# EAGLE design Sensor_Sound (EAGLE 9.6.2)
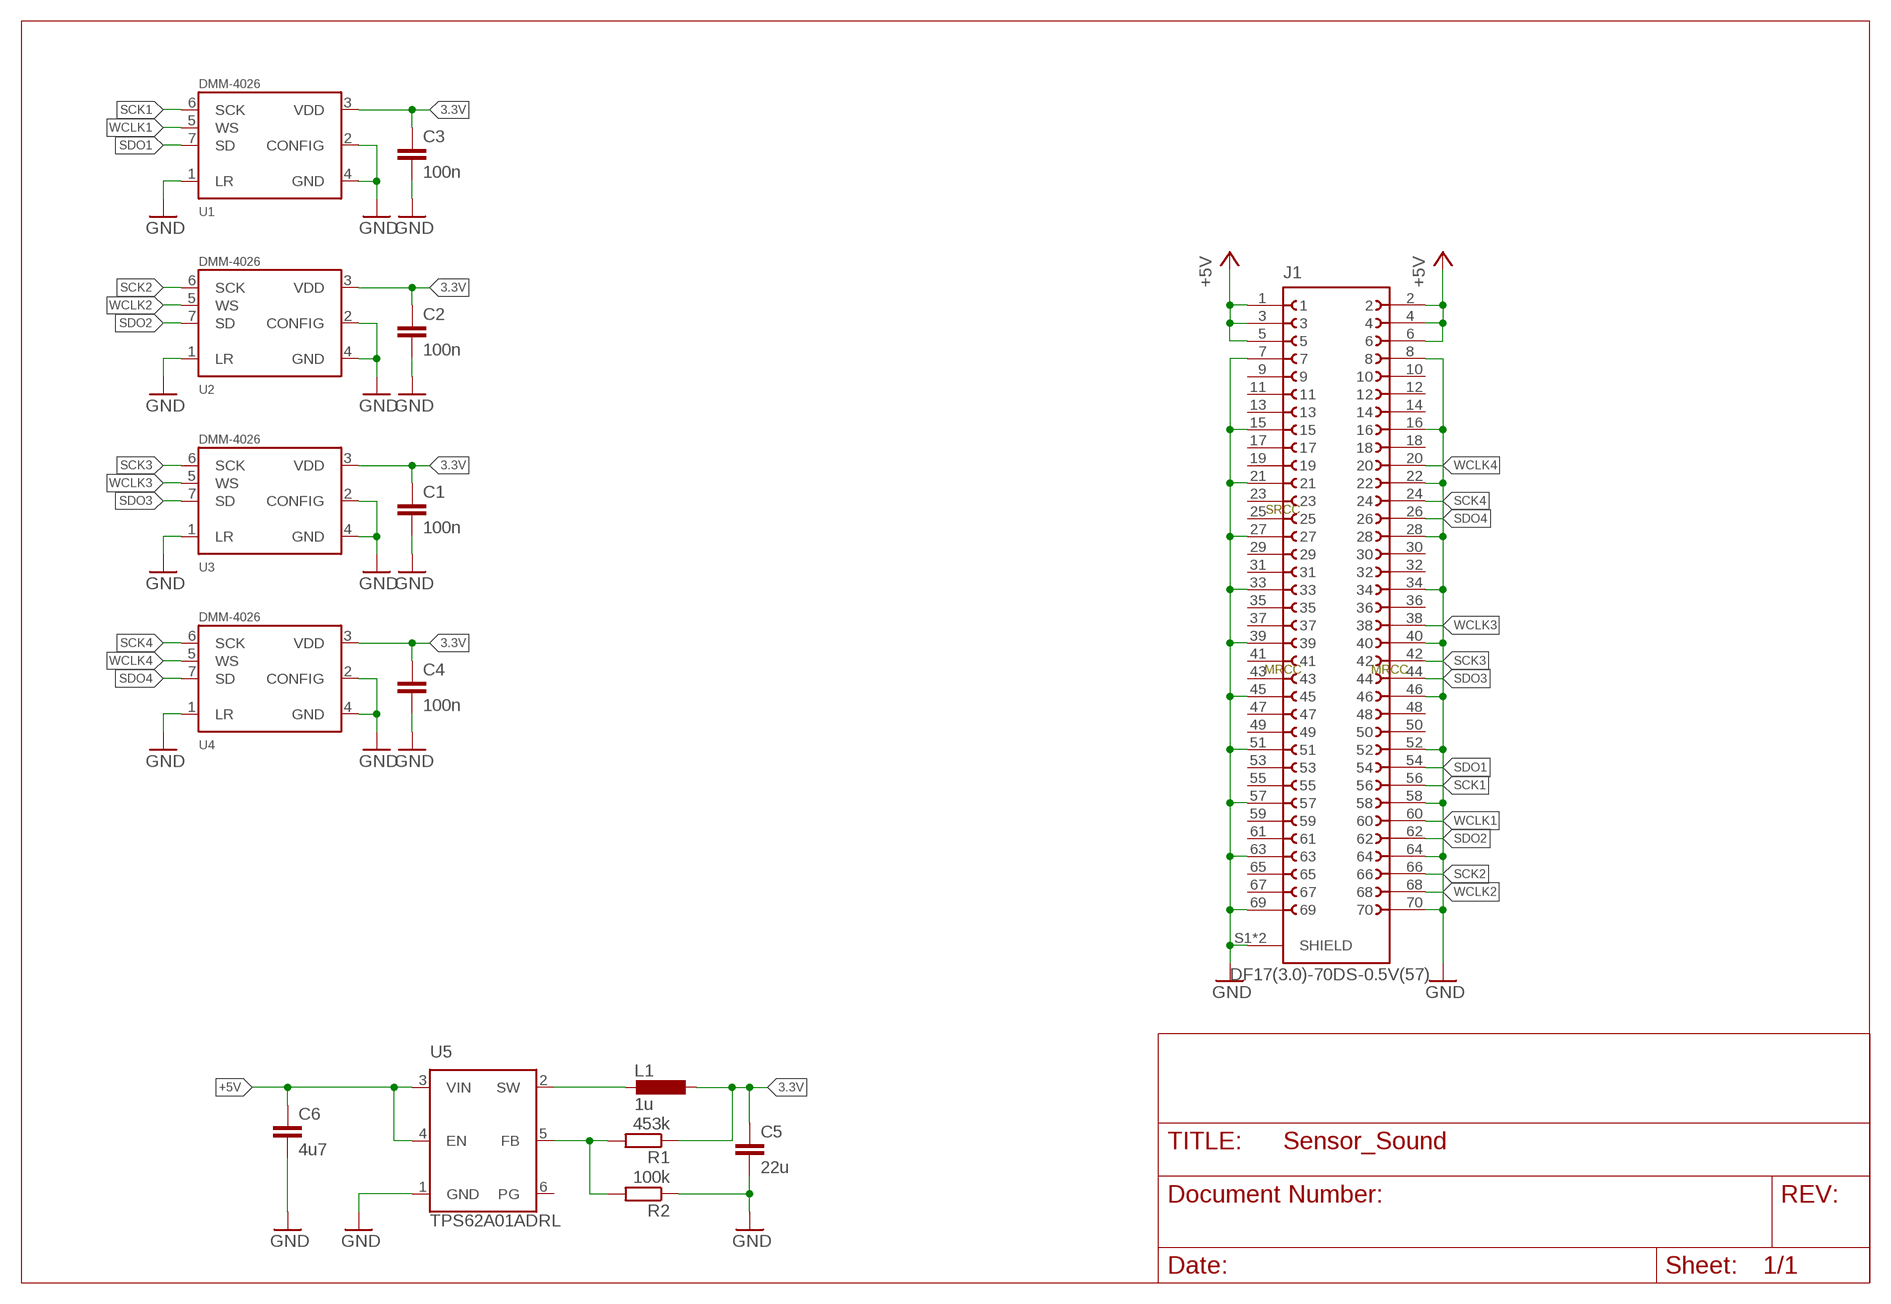
[diagram p0: schematic, sheet 1]

## Parts
C1  100n  C-EUC0402  [C0402]
C2  100n  C-EUC0402  [C0402]
C3  100n  C-EUC0402  [C0402]
C4  100n  C-EUC0402  [C0402]
C5  22u  C-EUC0603  [C0603]
C6  4u7  C-EUC0603  [C0603]
J1  DF17(3.0)-70DS-0.5V(57)  [DF17(3.0)-70DS-0.5V(57)]
L1  1u  L-EU1008  [L1008]
R1  453k  R-EU_R0402  [R0402]
R2  100k  R-EU_R0402  [R0402]
U1  DMM-4026  [DMM-4026]
U2  DMM-4026  [DMM-4026]
U3  DMM-4026  [DMM-4026]
U4  DMM-4026  [DMM-4026]
U5  TPS62A01ADRL  [SOTFL50P160X60-6N]

## Nets
3.3V: C1.1 C2.1 C3.1 C4.1 C5.1 L1.1 R1.1 U1.3(VDD) U2.3(VDD) U3.3(VDD) U4.3(VDD)
+5V: C6.1 J1.1 J1.2 J1.3 J1.4 J1.5 J1.6 U5.3(VIN) U5.4(EN)
GND: C1.2 C2.2 C3.2 C4.2 C5.2 C6.2 J1.7 J1.8 J1.15 J1.16 J1.21 J1.22 J1.27 J1.28 J1.33 J1.34 J1.39 J1.40 J1.45 J1.46 J1.51 J1.52 J1.57 J1.58 J1.63 J1.64 J1.69 J1.70 J1.S1(SHIELD) J1.S2(SHIELD) R2.1 U1.1(LR) U1.2(CONFIG) U1.4(GND) U2.1(LR) U2.2(CONFIG) U2.4(GND) U3.1(LR) U3.2(CONFIG) U3.4(GND) U4.1(LR) U4.2(CONFIG) U4.4(GND) U5.1(GND)
N$00044: R1.2 R2.2 U5.5(FB)
N$50: L1.2 U5.2(SW)
SCK1: J1.56 U1.6(SCK)
SCK2: J1.66 U2.6(SCK)
SCK3: J1.42 U3.6(SCK)
SCK4: J1.24 U4.6(SCK)
SDO1: J1.54 U1.7(SD)
SDO2: J1.62 U2.7(SD)
SDO3: J1.44 U3.7(SD)
SDO4: J1.26 U4.7(SD)
WCLK1: J1.60 U1.5(WS)
WCLK2: J1.68 U2.5(WS)
WCLK3: J1.38 U3.5(WS)
WCLK4: J1.20 U4.5(WS)
Unconnected: J1.9 J1.10 J1.11 J1.12 J1.13 J1.14 J1.17 J1.18 J1.19 J1.23 J1.25 J1.29 J1.30 J1.31 J1.32 J1.35 J1.36 J1.37 J1.41 J1.43 J1.47 J1.48 J1.49 J1.50 J1.53 J1.55 J1.59 J1.61 J1.65 J1.67 U5.6(PG)

## Notes on the sheet
- SRCC
- MRCC | MRCC

## Library data of the parts
C1-C4 = rcl:C-EU: CAPACITOR, European symbol; LCSC: C1525
C5 = rcl:C-EU: CAPACITOR, European symbol; LCSC: C109448
C6 = rcl:C-EU: CAPACITOR, European symbol; LCSC: C19666
J1 = Hirose:DF17(3.0)-70DS-0.5V(57)
L1 = rcl:L-EU: INDUCTOR, European symbol; DIGIKEY: 490-5112-1-ND; LCSC: C86091; MPN: LQM2HPN1R0MG0L
R1 = rcl:R-EU_: RESISTOR, European symbol; LCSC: C137978; SPICEPREFIX: R
R2 = rcl:R-EU_: RESISTOR, European symbol; DIGIKEY: RMCF0402FT100KCT-ND; LCSC: C60491; SPICEPREFIX: R
U1-U4 = pui_audio:DMM-4026: DMM-4026-B-I2S-R 24bit I2S Microphone
U5 = TPS62A01DRLR:TPS62A01ADRL; DESCRIPTION: 2.5V-5.5V input, 1-A high efficiency step-down converter in 2x2 QFN or SOT563 package; DIGIKEY: 296-TPS62A01ADRLRCT-ND; HEIGHT: 0.6mm; LCSC: C5181455; MANUFACTURER_NAME: Texas Instruments; MANUFACTURER_PART_NUMBER: TPS62A01ADRLR; MOUSER: 595-TPS62A01ADRLR

## Board
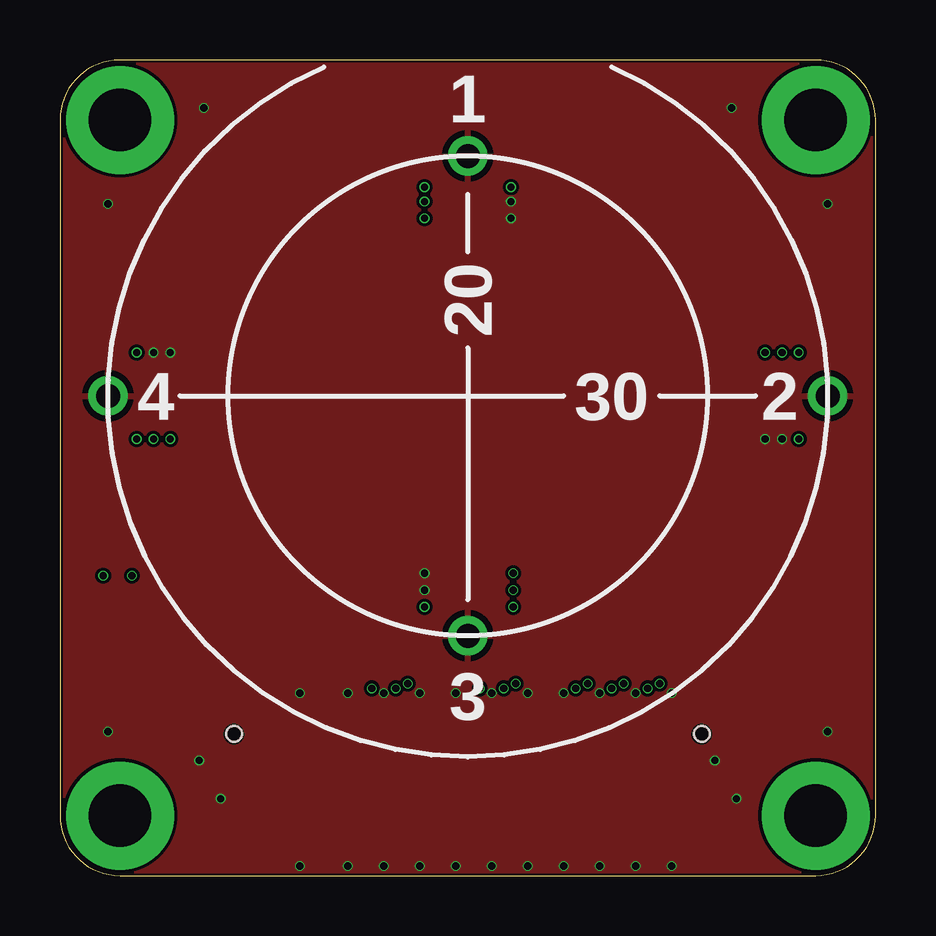
[diagram p1: board, top side]
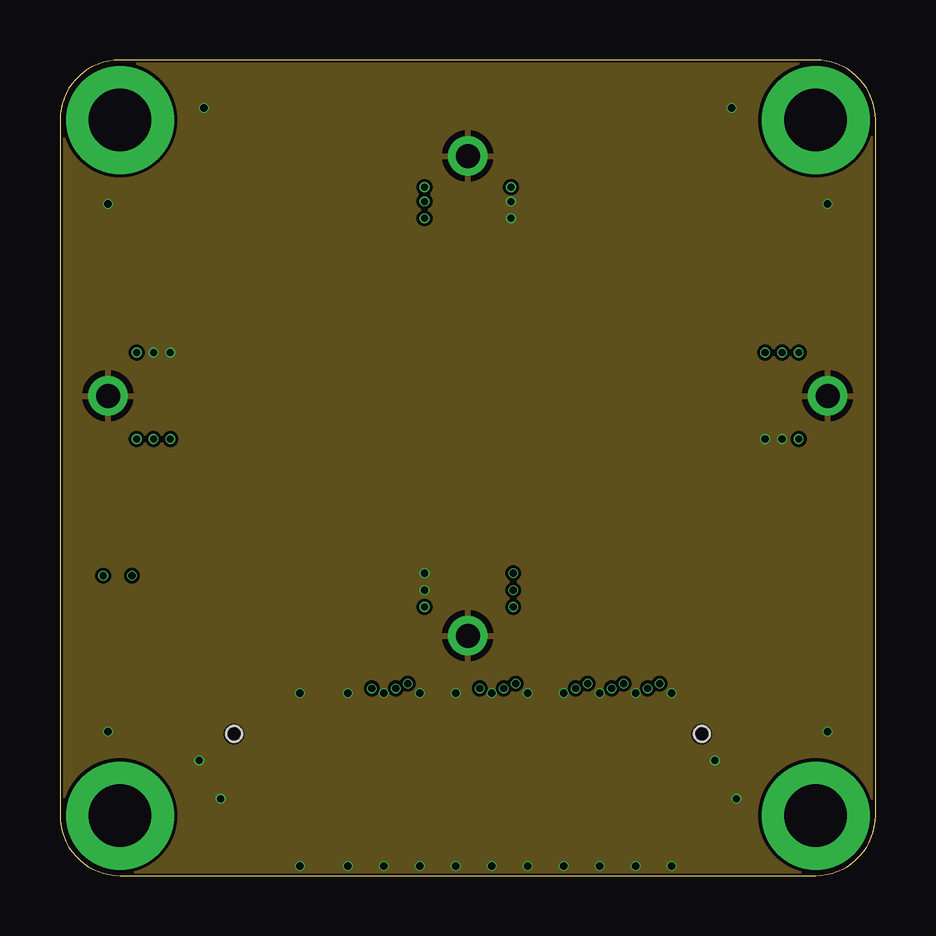
[diagram p2: board, inner layer Route2]
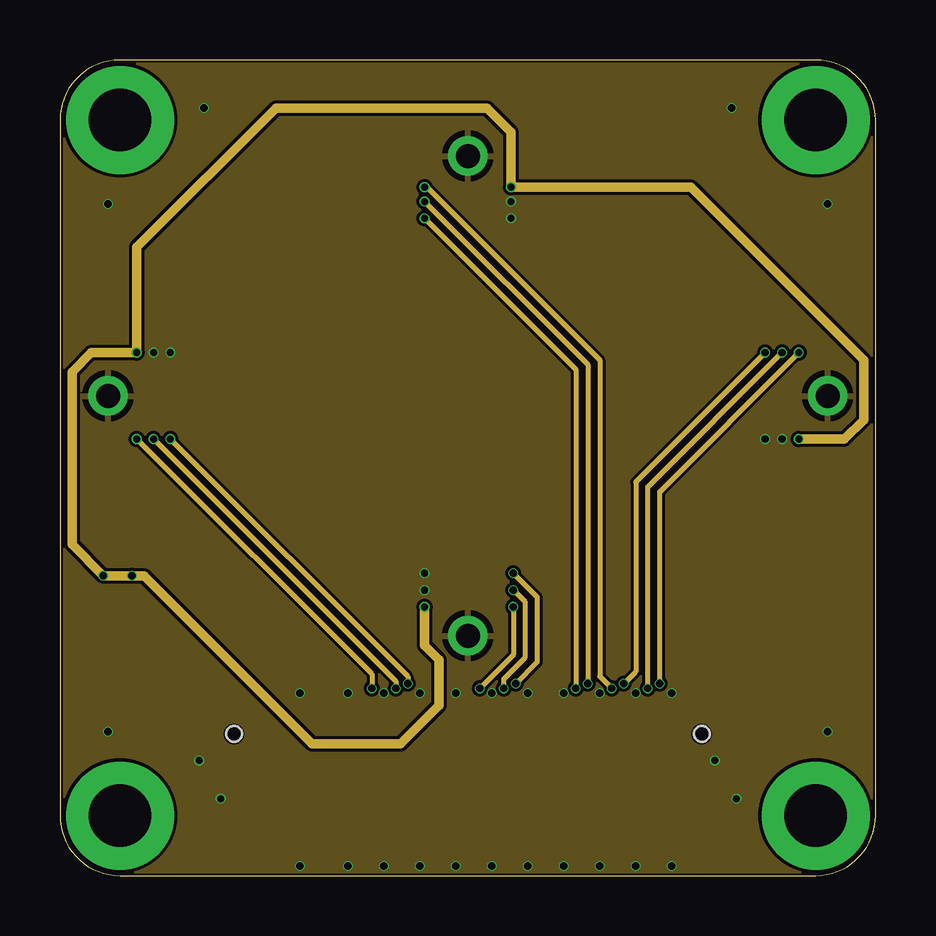
[diagram p3: board, inner layer Route15]
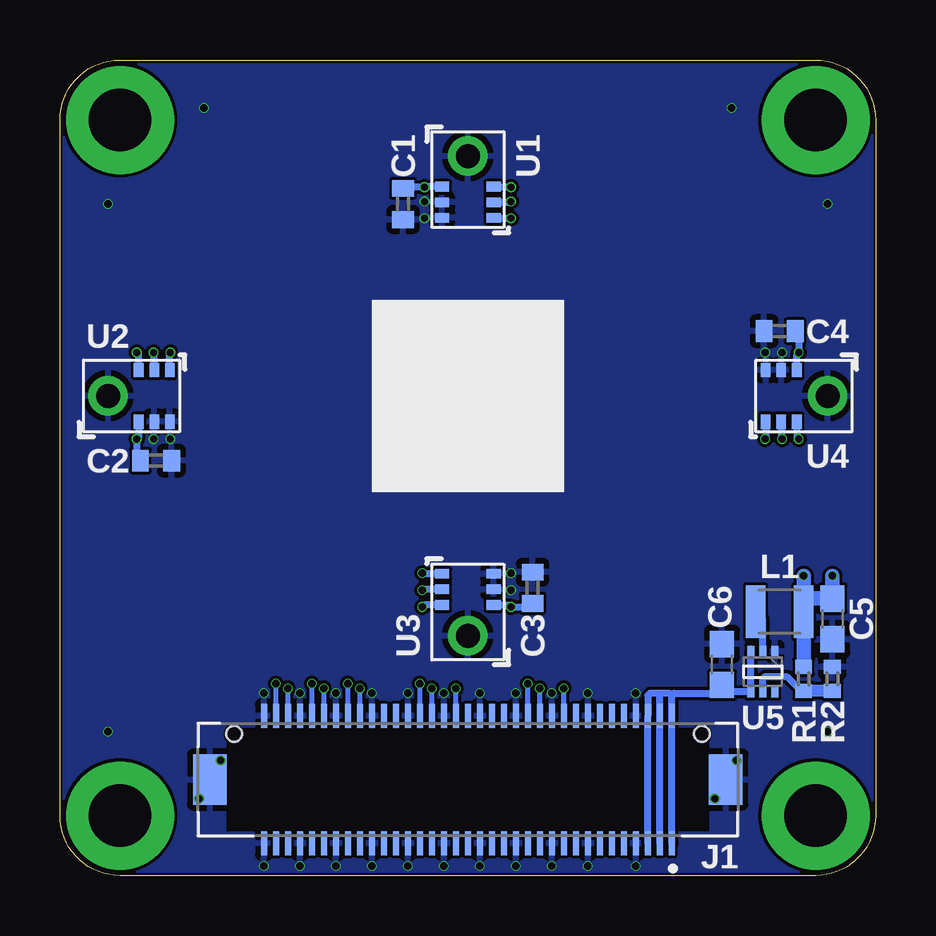
[diagram p4: board, bottom side, seen from below]

Size 34 x 34 mm. Coordinates in mm from the lower left corner, seen from the top.
Outline: 0,31.5 0,2.5 arc90 2.5,0 31.5,0 arc90 34,2.5 34,31.5 arc90 31.5,34 2.5,34 arc90 0,31.5
Copper layers (1*2*15*16): Top 0.035559375mm / dielectric 0.17018125mm / Route2 0.01778125mm / dielectric 47mil / Route15 0.01778125mm / dielectric 0.17018125mm / Bottom 0.035559375mm
Design rules "jlcpcb-4-layer *": minimum track width 5mil, minimum drill 0.2mm, track to track 5mil, track to pad 5mil, pad to pad 5mil, via to via 5mil, smd to smd 0mil, copper to edge 0.1mm, drill to drill 5mil, minimum pad ring 0.1mm, minimum via ring 0.05mm, stop-mask expansion 3mil, vias tented up to drill 100mil, thermal gap 10mil

### Footprints (pad centres in the part's own frame; a part is rotated, then mirrored left to right if it is on the bottom)
C0402 = smd 0.7 x 0.9: 1 -0.65,0; 2 0.65,0
C0603 = smd 1.1 x 1: 1 -0.85,0; 2 0.85,0
DF17(3.0)-70DS-0.5V(57) = smd 0.25 x 1: 1 -8.5,2.65; 2 -8.5,-2.65; 3 -8,2.65; 4 -8,-2.65; 5 -7.5,2.65; 6 -7.5,-2.65; 7 -7,2.65; 8 -7,-2.65; 9 -6.5,2.65; 10 -6.5,-2.65; 11 -6,2.65; 12 -6,-2.65; 13 -5.5,2.65; 14 -5.5,-2.65; 15 -5,2.65; 16 -5,-2.65; 17 -4.5,2.65; 18 -4.5,-2.65; 19 -4,2.65; 20 -4,-2.65; 21 -3.5,2.65; 22 -3.5,-2.65; 23 -3,2.65; 24 -3,-2.65; 25 -2.5,2.65; 26 -2.5,-2.65; 27 -2,2.65; 28 -2,-2.65; 29 -1.5,2.65; 30 -1.5,-2.65; 31 -1,2.65; 32 -1,-2.65; 33 -0.5,2.65; 34 -0.5,-2.65; 35 0,2.65; 36 0,-2.65; 37 0.5,2.65; 38 0.5,-2.65; 39 1,2.65; 40 1,-2.65; 41 1.5,2.65; 42 1.5,-2.65; 43 2,2.65; 44 2,-2.65; 45 2.5,2.65; 46 2.5,-2.65; 47 3,2.65; 48 3,-2.65; 49 3.5,2.65; 50 3.5,-2.65; 51 4,2.65; 52 4,-2.65; 53 4.5,2.65; 54 4.5,-2.65; 55 5,2.65; 56 5,-2.65; 57 5.5,2.65; 58 5.5,-2.65; 59 6,2.65; 60 6,-2.65; 61 6.5,2.65; 62 6.5,-2.65; 63 7,2.65; 64 7,-2.65; 65 7.5,2.65; 66 7.5,-2.65; 67 8,2.65; 68 8,-2.65; 69 8.5,2.65; 70 8.5,-2.65 | smd 1.4 x 2.1: S1 -10.75,0; S2 10.75,0 | hole 0.65: -9.75,-1.9; 9.75,-1.9
L1008 = smd 0.8 x 2.2: 1 -1,0; 2 1,0
R0402 = smd 0.6 x 0.7: 1 -0.5,0; 2 0.5,0
DMM-4026 = smd 0.6 x 0.4: 1 1.075,2.58; 2 1.075,1.93; 3 1.075,1.28; 5 -1.075,1.28; 6 -1.075,1.93; 7 -1.075,2.58 | drill 1 pad 1.65: 4 0,0
SOTFL50P160X60-6N = smd 0.475 x 0.3: 1 -0.838,0.5; 2 -0.838,0; 3 -0.838,-0.5; 4 0.838,-0.5; 5 0.838,0; 6 0.838,0.5

### Placement (x,y rotation side)
C1  19.7,28 270 bottom
C2  30,17.3 0 bottom
C3  14.3,12 90 bottom
C4  4,22.7 180 bottom
C5  1.8,10.7 270 bottom
C6  6.4,8.8 90 bottom
J1  17,4 180 bottom
L1  4,11 180 bottom
R1  3,8.2 270 bottom
R2  1.8,8.2 270 bottom
U1  17,30 180 bottom
U2  32,20 270 bottom
U3  17,10 0 bottom
U4  2,20 90 bottom
U5  4.7,8.5 270 bottom

### Tracks (layer width: path | path; a pad name or v marks a point on that pad's centre or on a via)
3.3V  (via drill 0.3)
  Route15 0.4: v30.8,18.2 32.7,18.2 33.5,19 33.5,21.5 26.3,28.7 v18.8,28.7 18.8,31 17.8,32 9,32 3.2,26.2 v3.2,21.8 1.3,21.8 0.5,21 0.5,13.8 v1.8,12.5 v3,12.5 3.5,12.5 10.5,5.5 14.2,5.5 15.8,7.1 15.8,9 15.2,9.6 v15.2,11.2
  Bottom 0.3: U2.3 30.72,18.28 v30.8,18.2 30.8,17.45 C2.1 | U1.3 18.78,28.72 v18.8,28.7 19.65,28.7 C1.1 | U3.3 15.28,11.28 v15.2,11.2 14.45,11.2 C3.1 | U4.3 3.28,21.72 v3.2,21.8 3.2,22.55 C4.1
  Bottom 0.5: 2.95,11.55 3,11.6 L1.1
  Bottom 0.6: R1.1 L1.1 v3,12.5 | 2.95,11.55 C5.1 v1.8,12.5
+5V
  Bottom 0.2: 6.6,7.6 6.32,7.88
  Bottom 0.3: J1.1 J1.2 8.5,7.5 | J1.3 J1.4 9,7.6 | J1.5 J1.6 9.5,7.5 9.4,7.6 9,7.6 | 8.5,7.5 8.6,7.6 9,7.6 | C6.1 6.32,7.88 6.11,7.66 U5.4 U5.3 | 8.5,7.5 8.4,7.6 6.6,7.6
GND  (via drill 0.3)
  other vias: 18,7.6 19.5,7.6 21,7.6 22.5,7.6 24,7.6 16.5,7.6 15,0.4 16.5,0.4 18,0.4 19.5,0.4 21,0.4 22.5,0.4 24,0.4 5.8,4.8 6.7,3.2 27.3,4.8 28.2,3.2 15,7.6 13.5,7.6 12,7.6 10,7.6 10,0.4 12,0.4 13.5,0.4 25.5,7.6 25.5,0.4 15.2,11.9 18.8,28.1 18.8,27.4 30.1,18.2 3.9,21.8 4.6,21.8 29.4,18.2 15.2,12.6 2,28 6,32 28,32 32,28 32,6 2,6
  pour Top: 0,0 34,0 34,34 0,34
  pour Bottom: 0,0 34,0 34,34 0,34
  pour Route2: 0,0 34,0 34,34 0,34
  pour Route15: 0,0 34,0 34,34 0,34
N$00025  (via drill 2.6 pad 4.5)
  other vias: 2.5,31.5
N$00026  (via drill 2.6 pad 4.5)
  other vias: 31.5,31.5
N$00027  (via drill 2.6 pad 4.5)
  other vias: 2.5,2.5
N$00028  (via drill 2.6 pad 4.5)
  other vias: 31.5,2.5
N$00044
  Bottom 0.3: U5.5 4.7,8.2 4.6,8.3 3.7,8.3 3.1,7.7 R1.2
  Bottom 0.5: R2.2 R1.2
N$50
  Bottom 0.2: 4.7,10.7 L1.2
  Bottom 0.3: U5.2 4.7,10.7
SCK1  (via drill 0.3)
  Route15 0.2: v22,8 22,21.3 v15.2,28.1
  Bottom 0.2: J1.56 v22,8
  Bottom 0.3: U1.6 15.23,28.07 v15.2,28.1
SCK2  (via drill 0.3)
  Route15 0.2: v24.5,7.8 24.5,16.2 v30.1,21.8
  Bottom 0.2: J1.66 v24.5,7.8
  Bottom 0.3: U2.6 30.07,21.77 v30.1,21.8
SCK3  (via drill 0.3)
  Route15 0.2: v18.5,7.8 18.5,8.2 19.4,9.1 19.4,11.4 v18.9,11.9
  Bottom 0.2: J1.42 v18.5,7.8
  Bottom 0.3: U3.6 18.87,11.93 v18.9,11.9
SCK4  (via drill 0.3)
  Route15 0.2: v14,7.8 14,8.1 v3.9,18.2
  Bottom 0.2: J1.24 v14,7.8
  Bottom 0.3: U4.6 3.93,18.23 v3.9,18.2
SDO1  (via drill 0.3)
  Route15 0.2: v21.5,7.8 21.5,21.1 v15.2,27.4
  Bottom 0.2: J1.54 v21.5,7.8
  Bottom 0.3: U1.7 15.9,27.4 v15.2,27.4
SDO2  (via drill 0.3)
  Route15 0.2: v23.5,8 24,8.5 24,16.4 v29.4,21.8
  Bottom 0.2: J1.62 v23.5,8
  Bottom 0.3: U2.7 29.42,21.78 v29.4,21.8
SDO3  (via drill 0.3)
  Route15 0.2: v19,8 19.9,8.9 19.9,11.6 v18.9,12.6
  Bottom 0.2: J1.44 v19,8
  Bottom 0.3: U3.7 18.88,12.58 v18.9,12.6
SDO4  (via drill 0.3)
  Route15 0.2: v14.5,8 14.5,8.3 v4.6,18.2
  Bottom 0.2: J1.26 v14.5,8
  Bottom 0.3: U4.7 4.58,18.22 v4.6,18.2
WCLK1  (via drill 0.3)
  Route15 0.2: v15.2,28.7 15.3,28.7 22.5,21.5 22.5,8.3 v23,7.8
  Bottom 0.2: J1.60 v23,7.8
  Bottom 0.3: U1.5 15.22,28.72 v15.2,28.7
WCLK2  (via drill 0.3)
  Route15 0.2: v25,8 25,16 v30.8,21.8
  Bottom 0.2: J1.68 v25,8
  Bottom 0.3: U2.5 30.72,21.72 v30.8,21.8
WCLK3  (via drill 0.3)
  Route15 0.2: v17.5,7.8 18.9,9.2 v18.9,11.2
  Bottom 0.2: J1.38 v17.5,7.8
  Bottom 0.3: U3.5 18.82,11.28 v18.9,11.2
WCLK4  (via drill 0.3)
  Route15 0.2: v13,7.8 13,8.4 v3.2,18.2
  Bottom 0.2: J1.20 v13,7.8
  Bottom 0.3: v3.2,18.2 3.28,18.28 U4.5

### Text on the board
tNames: 1 | 20 | 4 | 30 | 2 | 3
tStop: MICROPHONE / ARRAY